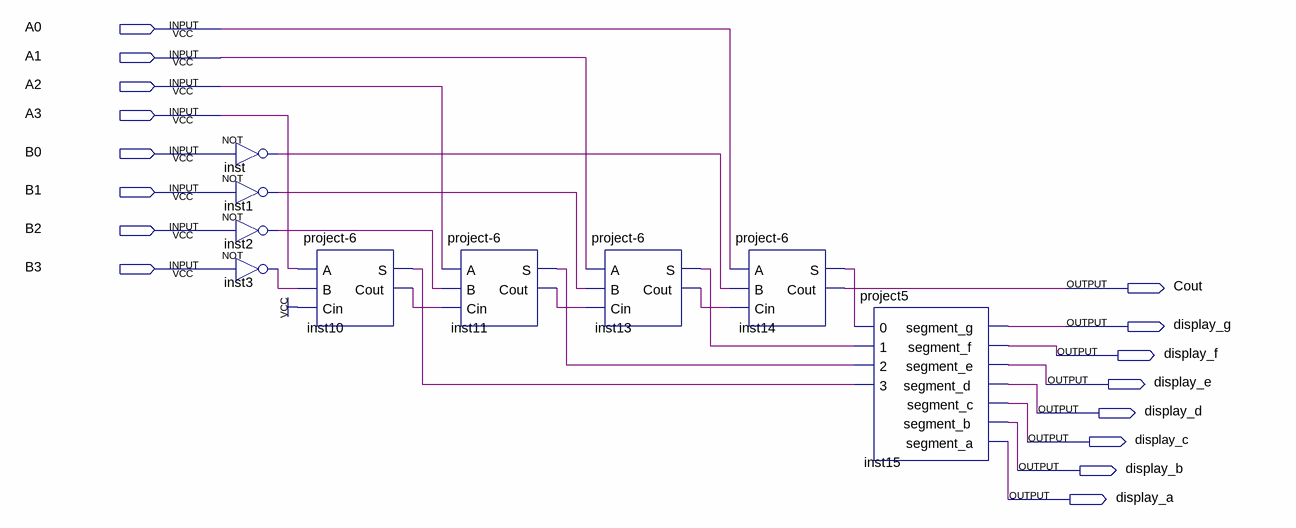
[diagram p0: schematic sheet]
// Quartus schematic project10.bdf as structural Verilog: 9 symbols, 16 pins
module project10 (
  input  A0,
  input  A1,
  input  A2,
  input  A3,
  input  B0,
  input  B1,
  input  B2,
  input  B3,
  output Cout,
  output display_g,
  output display_f,
  output display_e,
  output display_d,
  output display_c,
  output display_b,
  output display_a
);

  wire inst1_out, inst2_out, inst3_out, inst10_cout, inst10_s, inst11_cout, inst11_s, inst13_cout, inst13_s,
       inst14_s, inst_out;

  not inst (inst_out, B0);
  not inst1 (inst1_out, B1);
  not inst2 (inst2_out, B2);
  not inst3 (inst3_out, B3);
  \project-6  inst10 (.A(A3), .B(inst3_out), .Cin(1'b1), .S(inst10_s), .Cout(inst10_cout));
  \project-6  inst11 (.A(A2), .B(inst2_out), .Cin(inst10_cout), .S(inst11_s), .Cout(inst11_cout));
  \project-6  inst13 (.A(A1), .B(inst1_out), .Cin(inst11_cout), .S(inst13_s), .Cout(inst13_cout));
  \project-6  inst14 (.A(A0), .B(inst_out), .Cin(inst13_cout), .S(inst14_s), .Cout(Cout));
  project5 inst15 (
    .\0 (inst14_s), .\1 (inst13_s), .\2 (inst11_s), .\3 (inst10_s), .segment_g(display_g),
    .segment_f(display_f), .segment_e(display_e), .segment_d(display_d), .segment_c(display_c),
    .segment_b(display_b), .segment_a(display_a));
endmodule
